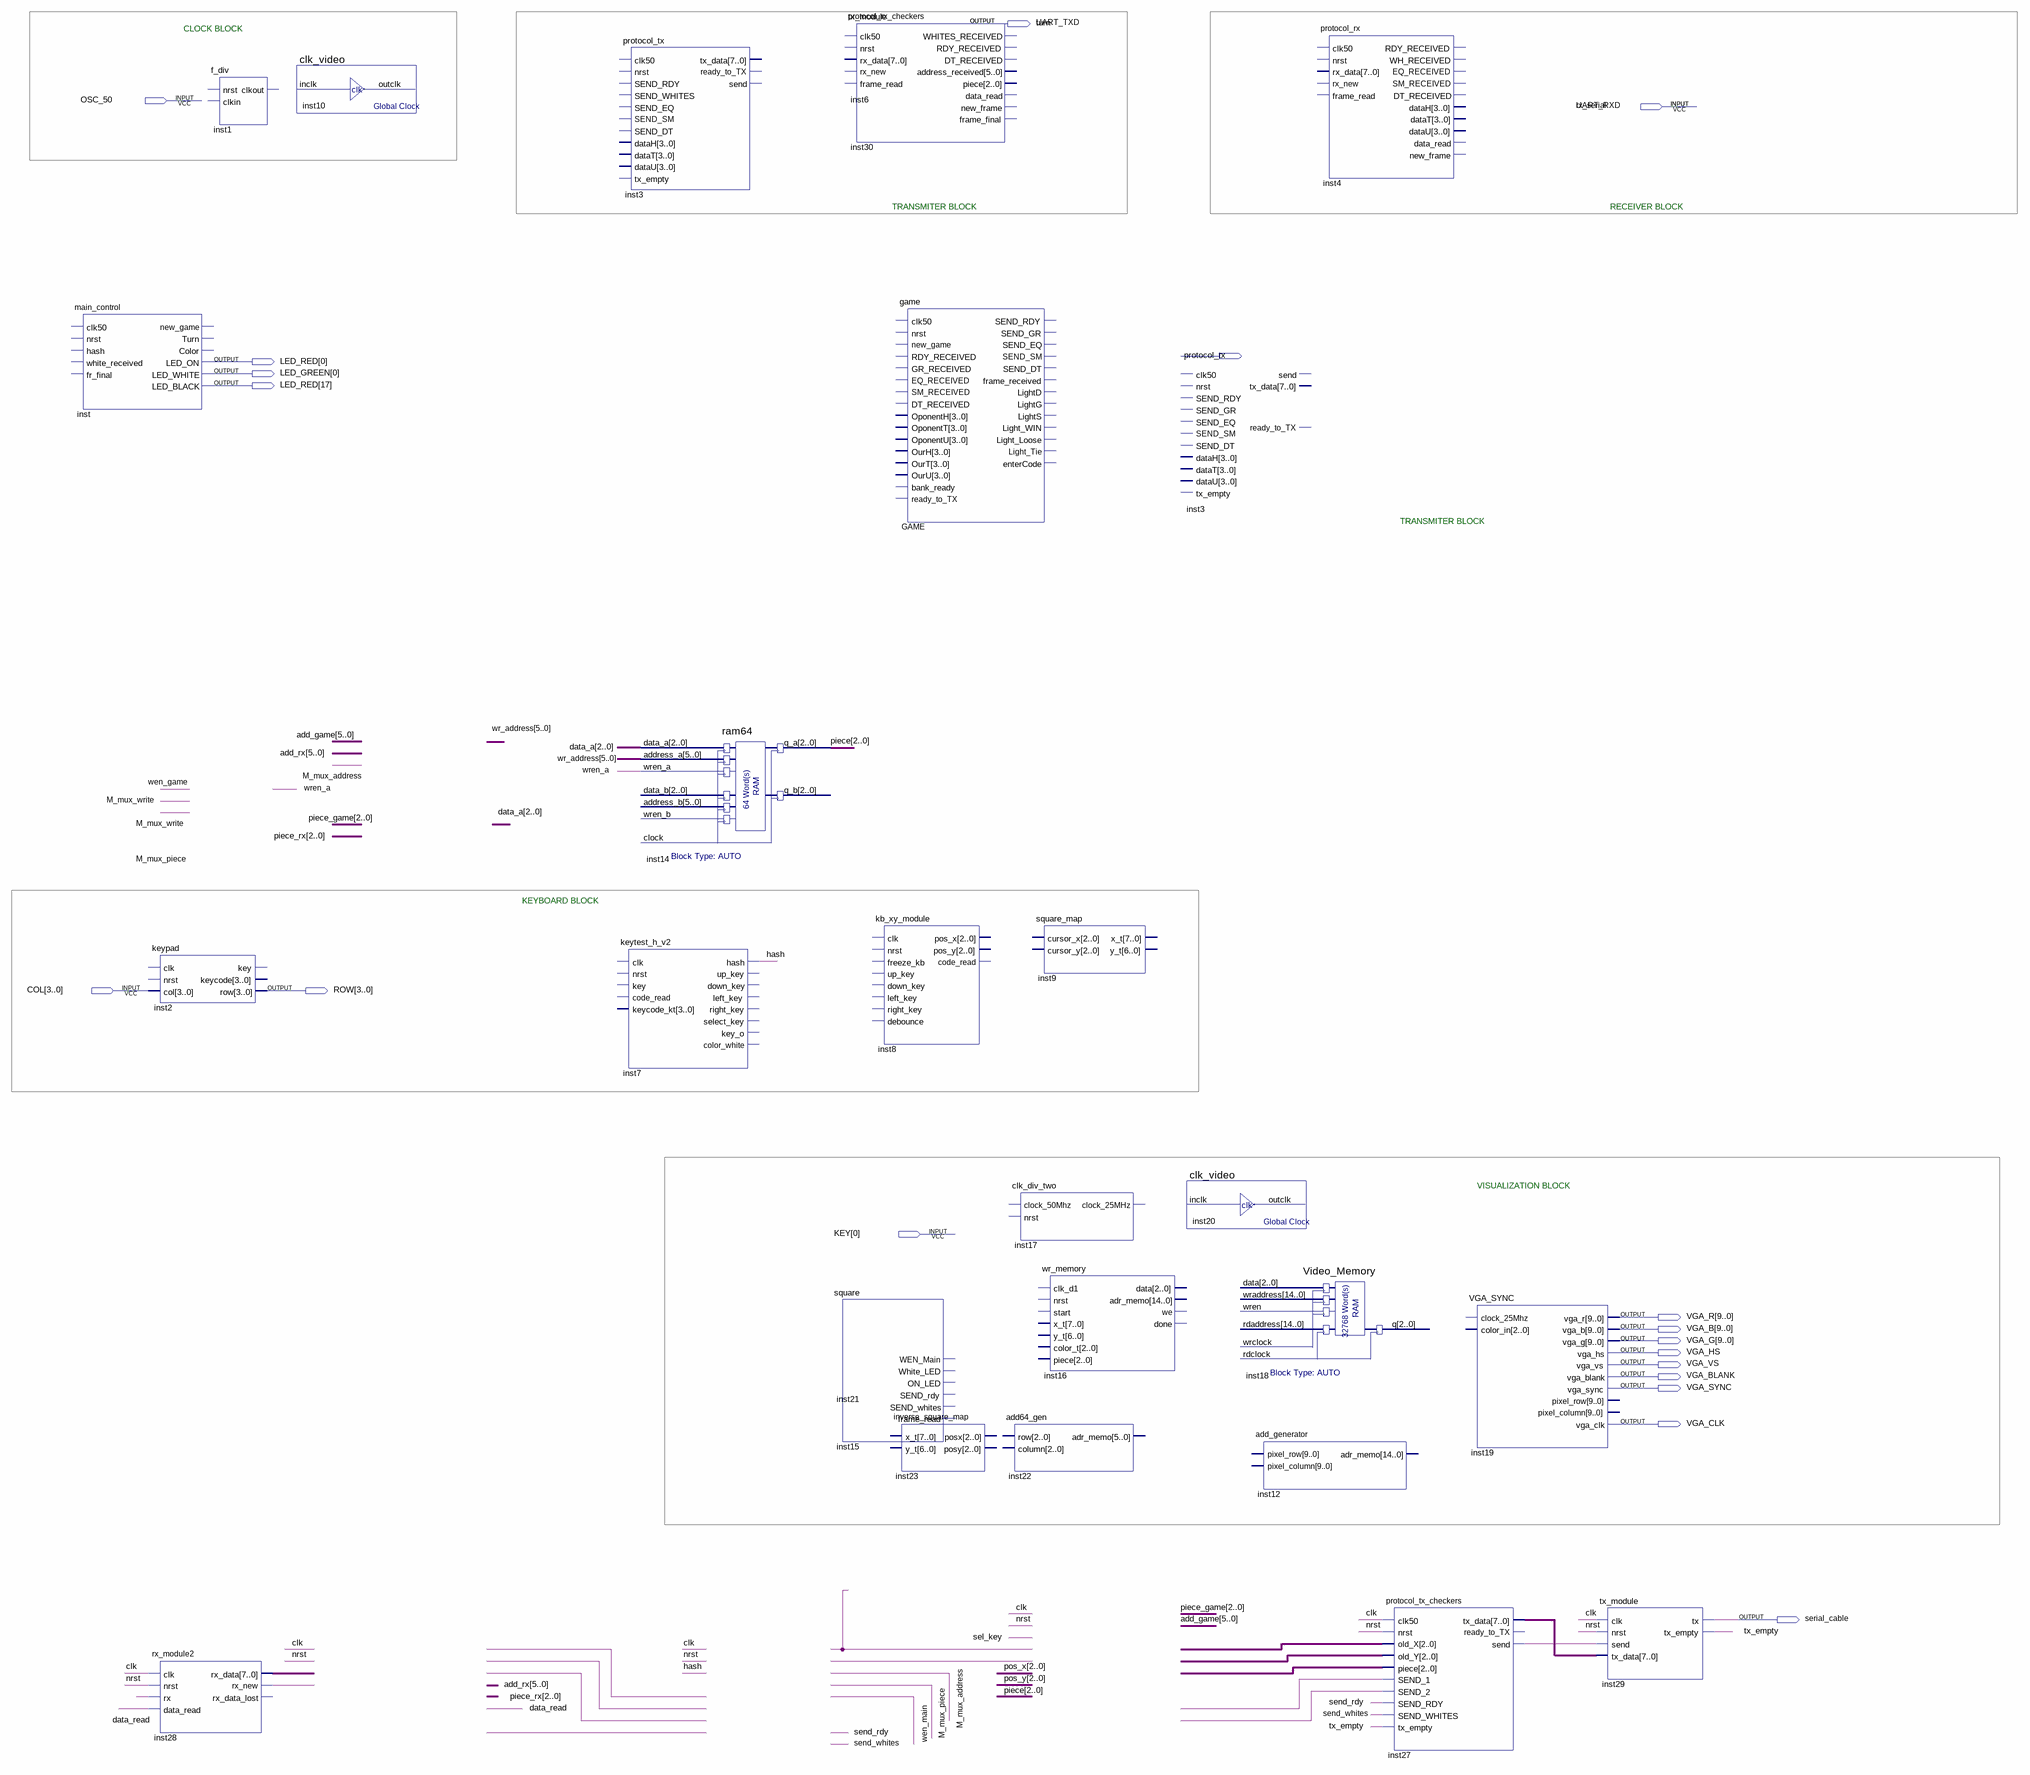
[diagram p0: schematic sheet]
// Quartus schematic P1_BOARD_vga.bdf as structural Verilog: 25 symbols, 18 pins
module P1_BOARD_vga (
  input  OSC_50,
  input  UART_RXD,
  input  [3:0] COL,
  input  [0:0] KEY,
  output UART_TXD,
  output [17:0] LED_RED,
  output [0:0] LED_GREEN,
  output [3:0] ROW,
  output [9:0] VGA_R,
  output [9:0] VGA_B,
  output [9:0] VGA_G,
  output VGA_HS,
  output VGA_VS,
  output VGA_BLANK,
  output VGA_SYNC,
  output VGA_CLK,
  output serial_cable
);

  wire clk, data_read, hash, inst27_send, inst28_rx_new, nrst, send_rdy, send_whites, tx_empty, undriven,
       undriven_5, undriven_6, wren_a;
  wire [2:0] data_a, piece, undriven_2, undriven_3, undriven_4;
  wire [5:0] wr_address;
  wire [7:0] inst27_tx_data, inst28_rx_data;

  main_control inst (
    .LED_ON(LED_RED[0]), .LED_WHITE(LED_GREEN[0]), .LED_BLACK(LED_RED[17]));  // open: clk50, nrst, hash, white_received, fr_final, new_game, Turn, Color
  keypad inst2 (.col(COL), .row(ROW));  // open: clk, nrst, key, keycode
  rx_module2 inst28 (
    .clk(clk), .nrst(nrst), .rx(undriven), .data_read(data_read), .rx_data(inst28_rx_data),
    .rx_new(inst28_rx_new));  // open: rx_data_lost
  f_div inst1 ();  // open: nrst, clkin, clkout
  clk_video inst10 ();  // open: inclk, outclk
  protocol_tx inst3 ();  // open: clk50, nrst, SEND_RDY, SEND_WHITES, SEND_EQ, SEND_SM, SEND_DT, dataH, dataT, dataU, tx_empty, tx_data, ready_to_TX, send
  keytest_h_v2 inst7 (.hash(hash));  // open: clk, nrst, key, code_read, keycode_kt, up_key, down_key, left_key, right_key, select_key, key_o, color_white
  ram64 inst14 (
    .data_a(data_a), .address_a(wr_address), .wren_a(wren_a), .q_a(piece));  // open: data_b, address_b, wren_b, clock, q_b
  tx_module inst6 ();  // open: clk50, nrst, rx_data, rx_new, frame_read, WHITES_RECEIVED, RDY_RECEIVED, DT_RECEIVED, address_received, piece, data_read, new_frame, frame_final
  square inst21 ();  // open: clk_d1, WEN_Main, White_LED, ON_LED, SEND_rdy, SEND_whites, frame_read
  game GAME ();  // open: clk50, nrst, new_game, RDY_RECEIVED, GR_RECEIVED, EQ_RECEIVED, SM_RECEIVED, DT_RECEIVED, OponentH, OponentT, OponentU, OurH, OurT, OurU, bank_ready, ready_to_TX, SEND_RDY, SEND_GR, SEND_EQ, SEND_SM, SEND_DT, frame_received, LightD, LightG, LightS, Light_WIN, Light_Loose, Light_Tie, enterCode
  kb_xy_module inst8 ();  // open: clk, nrst, freeze_kb, up_key, down_key, left_key, right_key, debounce, pos_x, pos_y, code_read
  inverse_square_map inst23 ();  // open: x_t, y_t, posx, posy
  square_map inst9 ();  // open: cursor_x, cursor_y, x_t, y_t
  clk_div_two inst17 ();  // open: clock_50Mhz, nrst, clock_25MHz
  wr_memory inst16 ();  // open: clk_d1, nrst, start, x_t, y_t, color_t, piece, data, adr_memo, we, done
  add64_gen inst22 ();  // open: row, column, adr_memo
  protocol_tx inst3_dup2 ();  // open: clk50, nrst, SEND_RDY, SEND_GR, SEND_EQ, SEND_SM, SEND_DT, dataH, dataT, dataU, tx_empty, tx_data, ready_to_TX, send
  clk_video inst20 ();  // open: inclk, outclk
  Video_Memory inst18 ();  // open: data, wraddress, wren, rdaddress, wrclock, rdclock, q
  add_generator inst12 ();  // open: pixel_row, pixel_column, adr_memo
  protocol_rx inst4 ();  // open: clk50, nrst, rx_data, rx_new, frame_read, RDY_RECEIVED, WH_RECEIVED, EQ_RECEIVED, SM_RECEIVED, DT_RECEIVED, dataH, dataT, dataU, data_read, new_frame
  protocol_tx_checkers inst27 (
    .clk50(clk), .nrst(nrst), .old_X(undriven_2), .old_Y(undriven_3), .piece(undriven_4),
    .SEND_1(undriven_5), .SEND_2(undriven_6), .SEND_RDY(send_rdy), .SEND_WHITES(send_whites),
    .tx_empty(tx_empty), .tx_data(inst27_tx_data), .send(inst27_send));  // open: ready_to_TX
  VGA_SYNC inst19 (
    .vga_r(VGA_R), .vga_b(VGA_B), .vga_g(VGA_G), .vga_hs(VGA_HS), .vga_vs(VGA_VS), .vga_blank(VGA_BLANK),
    .vga_sync(VGA_SYNC), .vga_clk(VGA_CLK));  // open: clock_25Mhz, color_in, pixel_row, pixel_column
  tx_module inst29 (
    .clk(clk), .nrst(nrst), .send(inst27_send), .tx_data(inst27_tx_data), .tx(serial_cable),
    .tx_empty(tx_empty));

  // Notes on the sheet:
  //   CLOCK BLOCK
  //   TRANSMITER BLOCK
  //   RECEIVER BLOCK
  //   TRANSMITER BLOCK
  //   KEYBOARD BLOCK
  //   VISUALIZATION BLOCK
endmodule
